# EAGLE design IO_board-ha-v1 (EAGLE 6.5.0)
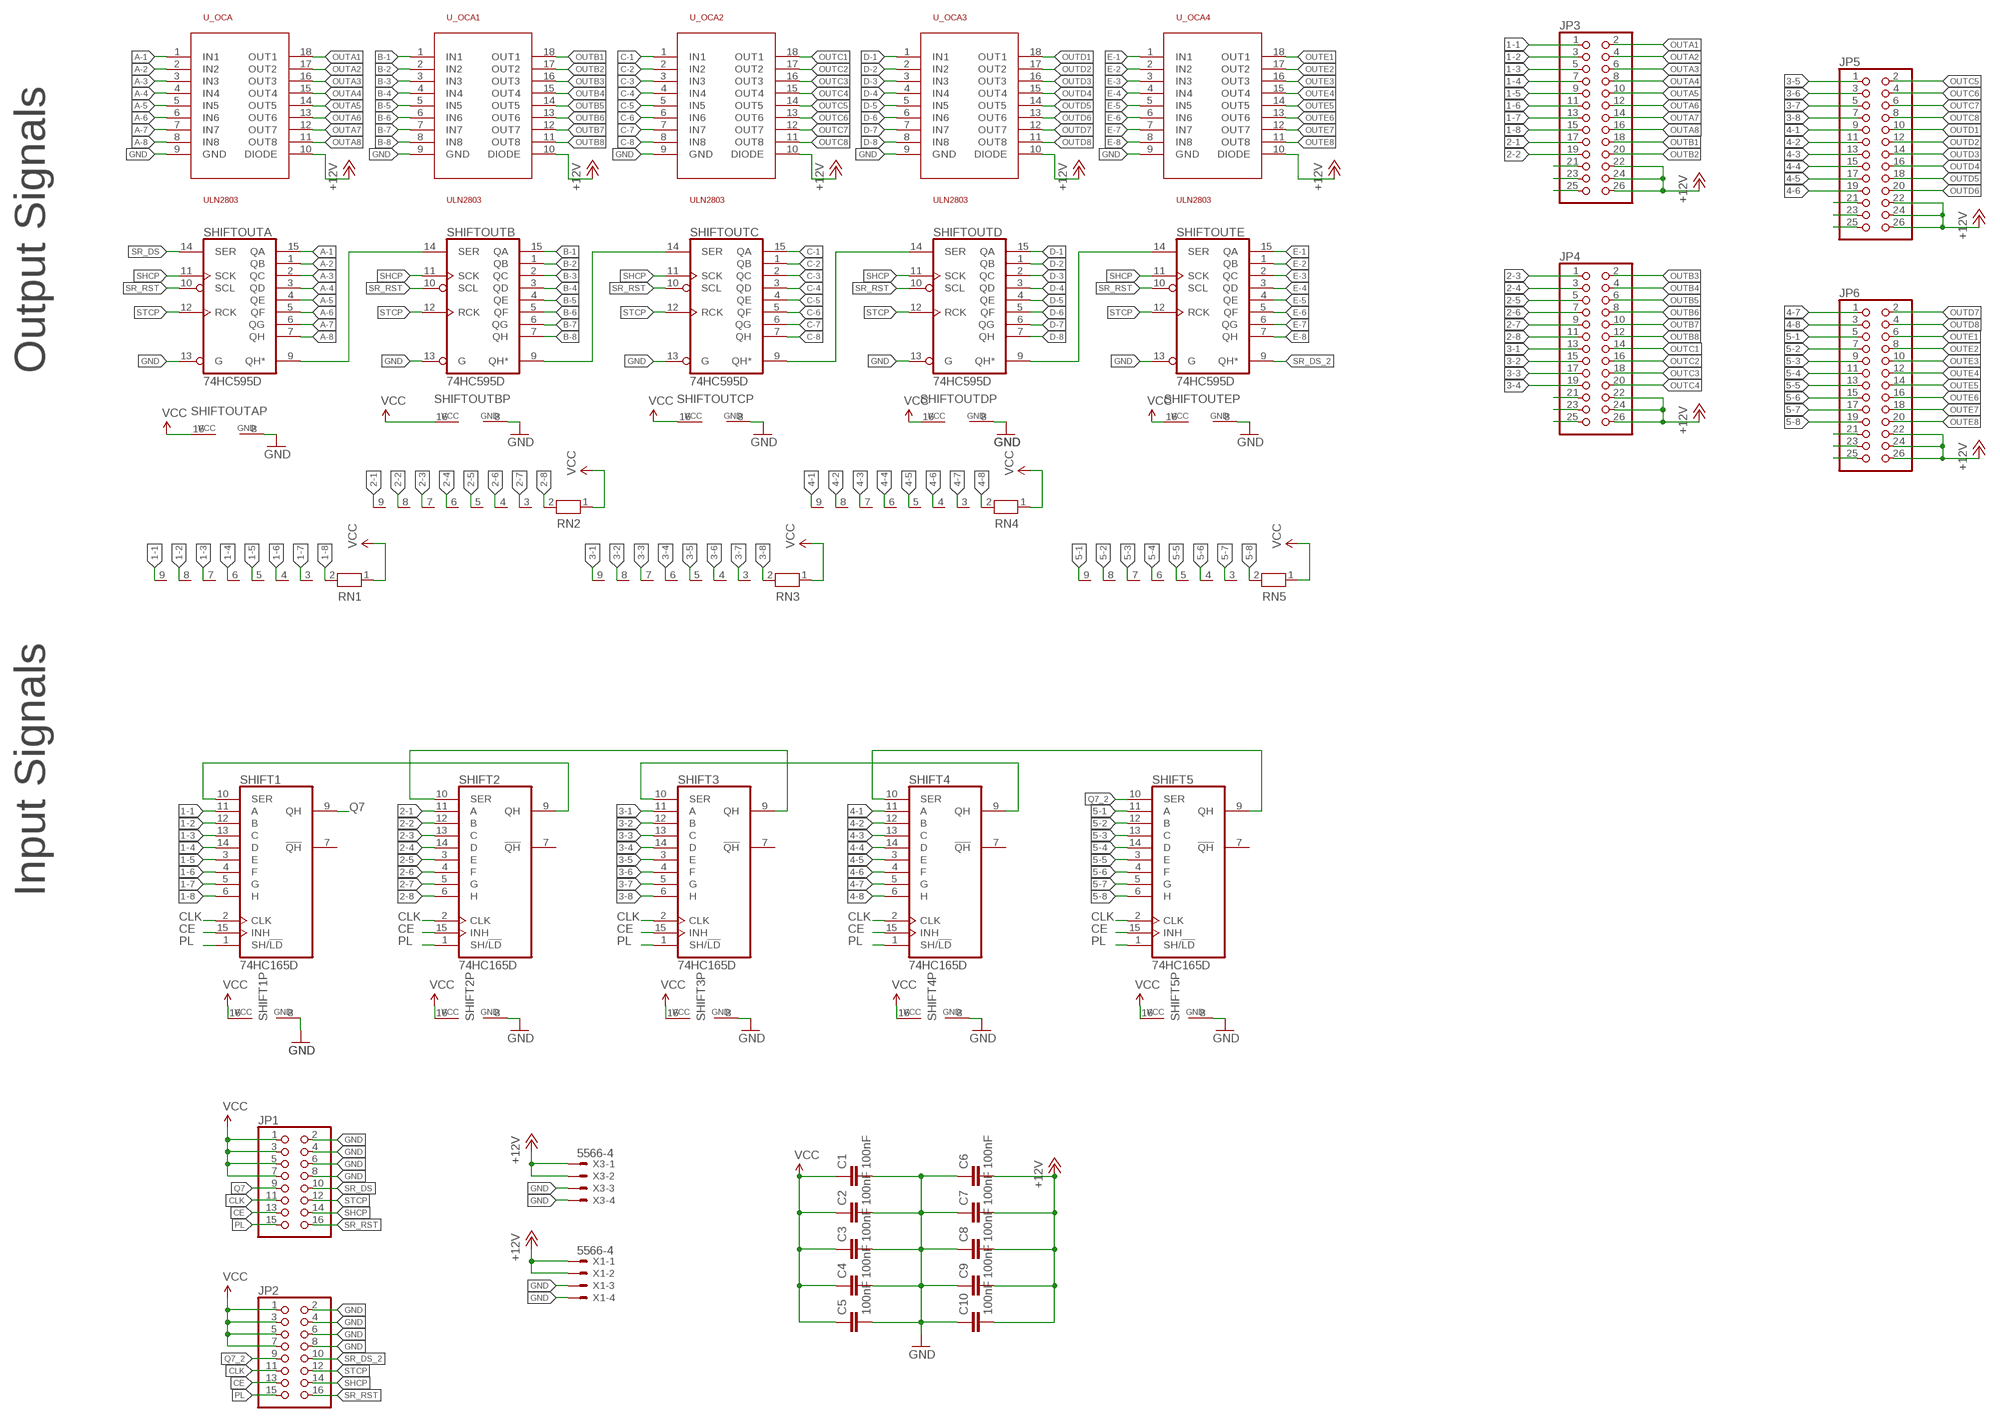
[diagram p0: schematic, sheet 1]

## Parts
C1  100nF  C-EUC0805  [C0805]
C2  100nF  C-EUC0805  [C0805]
C3  100nF  C-EUC0805  [C0805]
C4  100nF  C-EUC0805  [C0805]
C5  100nF  C-EUC0805  [C0805]
C6  100nF  C-EUC0805  [C0805]
C7  100nF  C-EUC0805  [C0805]
C8  100nF  C-EUC0805  [C0805]
C9  100nF  C-EUC0805  [C0805]
C10  100nF  C-EUC0805  [C0805]
JP1  PINHD-2X8  [2X08]
JP2  PINHD-2X8  [2X08]
JP3  PINHD-2X13  [2X13]
JP4  PINHD-2X13  [2X13]
JP5  PINHD-2X13  [2X13]
JP6  PINHD-2X13  [2X13]
RN1  RN08  [RN-9]
RN2  RN08  [RN-9]
RN3  RN08  [RN-9]
RN4  RN08  [RN-9]
RN5  RN08  [RN-9]
SHIFT1  74HC165D  [SO16]
SHIFT2  74HC165D  [SO16]
SHIFT3  74HC165D  [SO16]
SHIFT4  74HC165D  [SO16]
SHIFT5  74HC165D  [SO16]
SHIFTOUTA  74HC595D  [SO16]
SHIFTOUTB  74HC595D  [SO16]
SHIFTOUTC  74HC595D  [SO16]
SHIFTOUTD  74HC595D  [SO16]
SHIFTOUTE  74HC595D  [SO16]
U_OCA  ULN2803  [SO18L]
U_OCA1  ULN2803  [SO18L]
U_OCA2  ULN2803  [SO18L]
U_OCA3  ULN2803  [SO18L]
U_OCA4  ULN2803  [SO18L]
X1  5566-4  [5566-4]
X3  5566-4  [5566-4]

## Nets
1-1: JP3.1 RN1.9 SHIFT1.11(A)
1-2: JP3.3 RN1.8 SHIFT1.12(B)
1-3: JP3.5 RN1.7 SHIFT1.13(C)
1-4: JP3.7 RN1.6 SHIFT1.14(D)
1-5: JP3.9 RN1.5 SHIFT1.3(E)
1-6: JP3.11 RN1.4 SHIFT1.4(F)
1-7: JP3.13 RN1.3 SHIFT1.5(G)
1-8: JP3.15 RN1.2 SHIFT1.6(H)
2-1: JP3.17 RN2.9 SHIFT2.11(A)
2-2: JP3.19 RN2.8 SHIFT2.12(B)
2-3: JP4.1 RN2.7 SHIFT2.13(C)
2-4: JP4.3 RN2.6 SHIFT2.14(D)
2-5: JP4.5 RN2.5 SHIFT2.3(E)
2-6: JP4.7 RN2.4 SHIFT2.4(F)
2-7: JP4.9 RN2.3 SHIFT2.5(G)
2-8: JP4.11 RN2.2 SHIFT2.6(H)
3-1: JP4.13 RN3.9 SHIFT3.11(A)
3-2: JP4.15 RN3.8 SHIFT3.12(B)
3-3: JP4.17 RN3.7 SHIFT3.13(C)
3-4: JP4.19 RN3.6 SHIFT3.14(D)
3-5: JP5.1 RN3.5 SHIFT3.3(E)
3-6: JP5.3 RN3.4 SHIFT3.4(F)
3-7: JP5.5 RN3.3 SHIFT3.5(G)
3-8: JP5.7 RN3.2 SHIFT3.6(H)
4-1: JP5.9 RN4.9 SHIFT4.11(A)
4-2: JP5.11 RN4.8 SHIFT4.12(B)
4-3: JP5.13 RN4.7 SHIFT4.13(C)
4-4: JP5.15 RN4.6 SHIFT4.14(D)
4-5: JP5.17 RN4.5 SHIFT4.3(E)
4-6: JP5.19 RN4.4 SHIFT4.4(F)
4-7: JP6.1 RN4.3 SHIFT4.5(G)
4-8: JP6.3 RN4.2 SHIFT4.6(H)
5-1: JP6.5 RN5.9 SHIFT5.11(A)
5-2: JP6.7 RN5.8 SHIFT5.12(B)
5-3: JP6.9 RN5.7 SHIFT5.13(C)
5-4: JP6.11 RN5.6 SHIFT5.14(D)
5-5: JP6.13 RN5.5 SHIFT5.3(E)
5-6: JP6.15 RN5.4 SHIFT5.4(F)
5-7: JP6.17 RN5.3 SHIFT5.5(G)
5-8: JP6.19 RN5.2 SHIFT5.6(H)
+12V [power]: C6.2 C7.2 C8.2 C9.2 C10.2 JP3.22 JP3.24 JP3.26 JP4.22 JP4.24 JP4.26 JP5.22 JP5.24 JP5.26 JP6.22 JP6.24 JP6.26 U_OCA1.10(DIODE) U_OCA2.10(DIODE) U_OCA3.10(DIODE) U_OCA4.10(DIODE) U_OCA.10(DIODE) X1.1 X1.2 X3.1 X3.2
A-1: SHIFTOUTA.15(QA) U_OCA.1(IN1)
A-2: SHIFTOUTA.1(QB) U_OCA.2(IN2)
A-3: SHIFTOUTA.2(QC) U_OCA.3(IN3)
A-4: SHIFTOUTA.3(QD) U_OCA.4(IN4)
A-5: SHIFTOUTA.4(QE) U_OCA.5(IN5)
A-6: SHIFTOUTA.5(QF) U_OCA.6(IN6)
A-7: SHIFTOUTA.6(QG) U_OCA.7(IN7)
A-8: SHIFTOUTA.7(QH) U_OCA.8(IN8)
B-1: SHIFTOUTB.15(QA) U_OCA1.1(IN1)
B-2: SHIFTOUTB.1(QB) U_OCA1.2(IN2)
B-3: SHIFTOUTB.2(QC) U_OCA1.3(IN3)
B-4: SHIFTOUTB.3(QD) U_OCA1.4(IN4)
B-5: SHIFTOUTB.4(QE) U_OCA1.5(IN5)
B-6: SHIFTOUTB.5(QF) U_OCA1.6(IN6)
B-7: SHIFTOUTB.6(QG) U_OCA1.7(IN7)
B-8: SHIFTOUTB.7(QH) U_OCA1.8(IN8)
C-1: SHIFTOUTC.15(QA) U_OCA2.1(IN1)
C-2: SHIFTOUTC.1(QB) U_OCA2.2(IN2)
C-3: SHIFTOUTC.2(QC) U_OCA2.3(IN3)
C-4: SHIFTOUTC.3(QD) U_OCA2.4(IN4)
C-5: SHIFTOUTC.4(QE) U_OCA2.5(IN5)
C-6: SHIFTOUTC.5(QF) U_OCA2.6(IN6)
C-7: SHIFTOUTC.6(QG) U_OCA2.7(IN7)
C-8: SHIFTOUTC.7(QH) U_OCA2.8(IN8)
CE: JP1.13 JP2.13 SHIFT1.15(INH) SHIFT2.15(INH) SHIFT3.15(INH) SHIFT4.15(INH) SHIFT5.15(INH)
CLK: JP1.11 JP2.11 SHIFT1.2(CLK) SHIFT2.2(CLK) SHIFT3.2(CLK) SHIFT4.2(CLK) SHIFT5.2(CLK)
D-1: SHIFTOUTD.15(QA) U_OCA3.1(IN1)
D-2: SHIFTOUTD.1(QB) U_OCA3.2(IN2)
D-3: SHIFTOUTD.2(QC) U_OCA3.3(IN3)
D-4: SHIFTOUTD.3(QD) U_OCA3.4(IN4)
D-5: SHIFTOUTD.4(QE) U_OCA3.5(IN5)
D-6: SHIFTOUTD.5(QF) U_OCA3.6(IN6)
D-7: SHIFTOUTD.6(QG) U_OCA3.7(IN7)
D-8: SHIFTOUTD.7(QH) U_OCA3.8(IN8)
E-1: SHIFTOUTE.15(QA) U_OCA4.1(IN1)
E-2: SHIFTOUTE.1(QB) U_OCA4.2(IN2)
E-3: SHIFTOUTE.2(QC) U_OCA4.3(IN3)
E-4: SHIFTOUTE.3(QD) U_OCA4.4(IN4)
E-5: SHIFTOUTE.4(QE) U_OCA4.5(IN5)
E-6: SHIFTOUTE.5(QF) U_OCA4.6(IN6)
E-7: SHIFTOUTE.6(QG) U_OCA4.7(IN7)
E-8: SHIFTOUTE.7(QH) U_OCA4.8(IN8)
GND [GND]: C1.2 C2.2 C3.2 C4.2 C5.2 C6.1 C7.1 C8.1 C9.1 C10.1 JP1.2 JP1.4 JP1.6 JP1.8 JP2.2 JP2.4 JP2.6 JP2.8 JP3.21 JP3.23 JP3.25 JP4.21 JP4.23 JP4.25 JP5.21 JP5.23 JP5.25 JP6.21 JP6.23 JP6.25 SHIFT1.8(GND) SHIFT2.8(GND) SHIFT3.8(GND) SHIFT4.8(GND) SHIFT5.8(GND) SHIFTOUTA.8(GND) SHIFTOUTA.13(G) SHIFTOUTB.8(GND) SHIFTOUTB.13(G) SHIFTOUTC.8(GND) SHIFTOUTC.13(G) SHIFTOUTD.8(GND) SHIFTOUTD.13(G) SHIFTOUTE.8(GND) SHIFTOUTE.13(G) U_OCA1.9(GND) U_OCA2.9(GND) U_OCA3.9(GND) U_OCA4.9(GND) U_OCA.9(GND) X1.3 X1.4 X3.3 X3.4
N$18: SHIFT2.10(SER) SHIFT3.9(QH)
N$21: SHIFT3.10(SER) SHIFT4.9(QH)
N$22: SHIFT4.10(SER) SHIFT5.9(QH)
N$26: SHIFTOUTA.9(QH*) SHIFTOUTB.14(SER)
N$31: SHIFTOUTC.9(QH*) SHIFTOUTD.14(SER)
N$37: SHIFTOUTB.9(QH*) SHIFTOUTC.14(SER)
N$38: SHIFTOUTD.9(QH*) SHIFTOUTE.14(SER)
N$50: SHIFT1.10(SER) SHIFT2.9(QH)
OUTA1: JP3.2 U_OCA.18(OUT1)
OUTA2: JP3.4 U_OCA.17(OUT2)
OUTA3: JP3.6 U_OCA.16(OUT3)
OUTA4: JP3.8 U_OCA.15(OUT4)
OUTA5: JP3.10 U_OCA.14(OUT5)
OUTA6: JP3.12 U_OCA.13(OUT6)
OUTA7: JP3.14 U_OCA.12(OUT7)
OUTA8: JP3.16 U_OCA.11(OUT8)
OUTB1: JP3.18 U_OCA1.18(OUT1)
OUTB2: JP3.20 U_OCA1.17(OUT2)
OUTB3: JP4.2 U_OCA1.16(OUT3)
OUTB4: JP4.4 U_OCA1.15(OUT4)
OUTB5: JP4.6 U_OCA1.14(OUT5)
OUTB6: JP4.8 U_OCA1.13(OUT6)
OUTB7: JP4.10 U_OCA1.12(OUT7)
OUTB8: JP4.12 U_OCA1.11(OUT8)
OUTC1: JP4.14 U_OCA2.18(OUT1)
OUTC2: JP4.16 U_OCA2.17(OUT2)
OUTC3: JP4.18 U_OCA2.16(OUT3)
OUTC4: JP4.20 U_OCA2.15(OUT4)
OUTC5: JP5.2 U_OCA2.14(OUT5)
OUTC6: JP5.4 U_OCA2.13(OUT6)
OUTC7: JP5.6 U_OCA2.12(OUT7)
OUTC8: JP5.8 U_OCA2.11(OUT8)
OUTD1: JP5.10 U_OCA3.18(OUT1)
OUTD2: JP5.12 U_OCA3.17(OUT2)
OUTD3: JP5.14 U_OCA3.16(OUT3)
OUTD4: JP5.16 U_OCA3.15(OUT4)
OUTD5: JP5.18 U_OCA3.14(OUT5)
OUTD6: JP5.20 U_OCA3.13(OUT6)
OUTD7: JP6.2 U_OCA3.12(OUT7)
OUTD8: JP6.4 U_OCA3.11(OUT8)
OUTE1: JP6.6 U_OCA4.18(OUT1)
OUTE2: JP6.8 U_OCA4.17(OUT2)
OUTE3: JP6.10 U_OCA4.16(OUT3)
OUTE4: JP6.12 U_OCA4.15(OUT4)
OUTE5: JP6.14 U_OCA4.14(OUT5)
OUTE6: JP6.16 U_OCA4.13(OUT6)
OUTE7: JP6.18 U_OCA4.12(OUT7)
OUTE8: JP6.20 U_OCA4.11(OUT8)
PL: JP1.15 JP2.15 SHIFT1.1(SH/!LD) SHIFT2.1(SH/!LD) SHIFT3.1(SH/!LD) SHIFT4.1(SH/!LD) SHIFT5.1(SH/!LD)
Q7: JP1.9 SHIFT1.9(QH)
Q7_2: JP2.9 SHIFT5.10(SER)
SHCP: JP1.14 JP2.14 SHIFTOUTA.11(SCK) SHIFTOUTB.11(SCK) SHIFTOUTC.11(SCK) SHIFTOUTD.11(SCK) SHIFTOUTE.11(SCK)
SR_DS: JP1.10 SHIFTOUTA.14(SER)
SR_DS_2: JP2.10 SHIFTOUTE.9(QH*)
SR_RST: JP1.16 JP2.16 SHIFTOUTA.10(SCL) SHIFTOUTB.10(SCL) SHIFTOUTC.10(SCL) SHIFTOUTD.10(SCL) SHIFTOUTE.10(SCL)
STCP: JP1.12 JP2.12 SHIFTOUTA.12(RCK) SHIFTOUTB.12(RCK) SHIFTOUTC.12(RCK) SHIFTOUTD.12(RCK) SHIFTOUTE.12(RCK)
VCC [power]: C1.1 C2.1 C3.1 C4.1 C5.1 JP1.1 JP1.3 JP1.5 JP1.7 JP2.1 JP2.3 JP2.5 JP2.7 RN1.1 RN2.1 RN3.1 RN4.1 RN5.1 SHIFT1.16(VCC) SHIFT2.16(VCC) SHIFT3.16(VCC) SHIFT4.16(VCC) SHIFT5.16(VCC) SHIFTOUTA.16(VCC) SHIFTOUTB.16(VCC) SHIFTOUTC.16(VCC) SHIFTOUTD.16(VCC) SHIFTOUTE.16(VCC)
Unconnected: SHIFT1.7(!QH) SHIFT2.7(!QH) SHIFT3.7(!QH) SHIFT4.7(!QH) SHIFT5.7(!QH)

## Notes on the sheet
- Output Signals
- Input Signals

## Library data of the parts
C1-C10 = resistor:C-EU: CAPACITOR, European symbol
JP1 JP2 = pinhead:PINHD-2X8: PIN HEADER
JP3-JP6 = pinhead:PINHD-2X13: PIN HEADER
RN1-RN5 = resistor-net:RN08: RESISTOR NETWORK; OC_FARNELL: unknown; OC_NEWARK: unknown
SHIFT1-SHIFT5 = 74xx-eu:74*165: 8-bit parallel load SHIFT REGISTER
SHIFTOUTA SHIFTOUTB SHIFTOUTC SHIFTOUTD SHIFTOUTE = 74xx-eu:74*595: 8-bit SHIFT REGISTER, output latch
U_OCA U_OCA1-U_OCA4 = uln2803:ULN2803
X1 X3 = con-molex:5566-4: Mini FIT connector 4 pol Source: http://www.molex.com; OC_FARNELL: unknown; OC_NEWARK: unknown

## Net classes
1 power: width 0.305 mm, drill 0.6 mm, clearance 0.813 mm
2 GND: width 0.305 mm, drill 0.6 mm, clearance 0.508 mm
3 LIVEAC: width 0.508 mm, drill 0.508 mm, clearance 1.27 mm

## Board
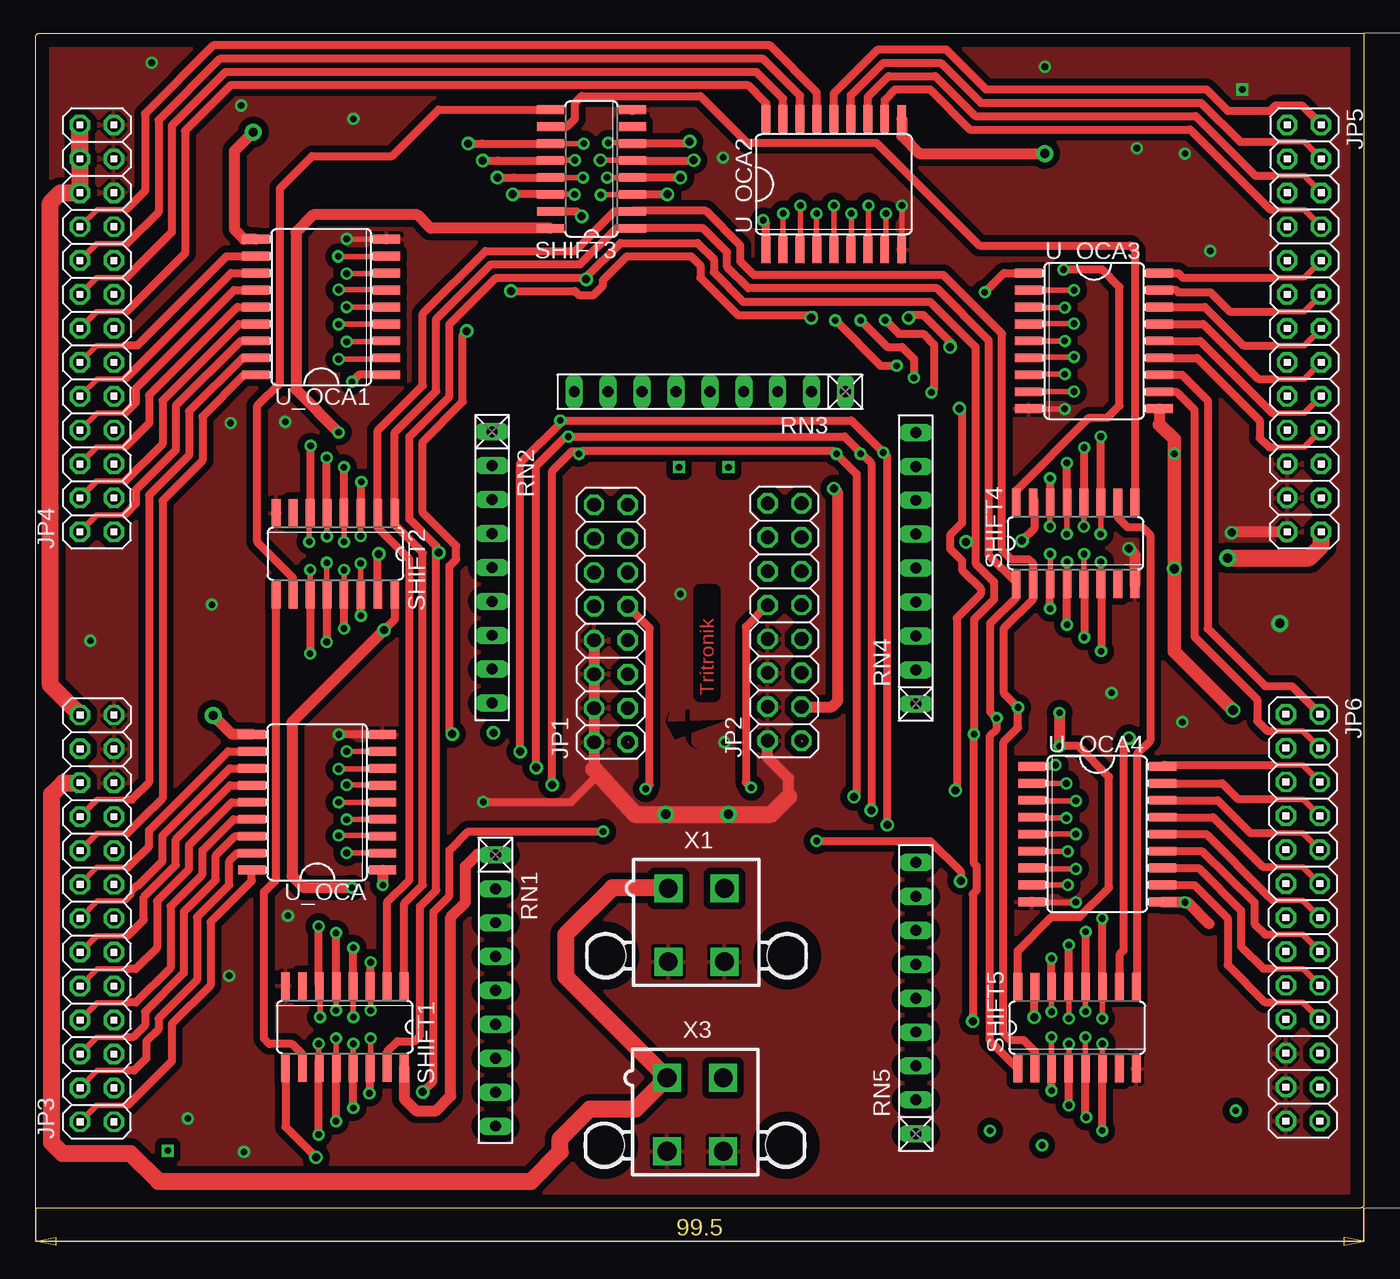
[diagram p1: board, top side]
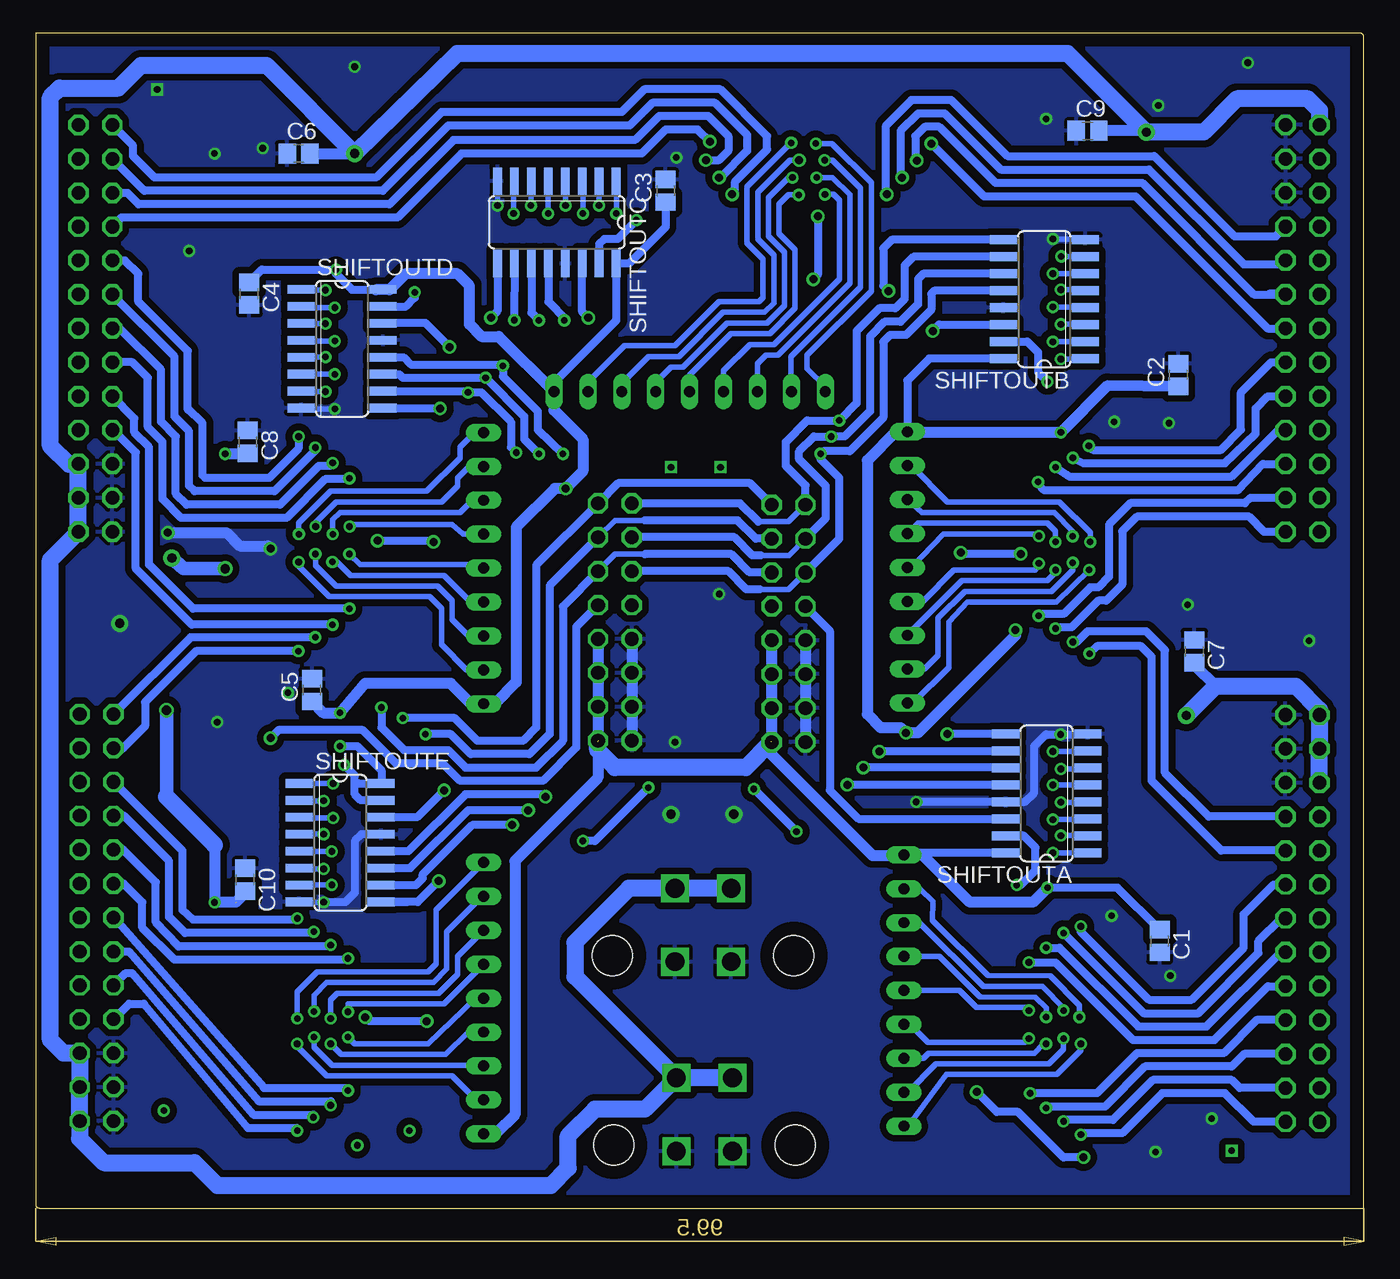
[diagram p2: board, bottom side, seen from below]

Size 99.5 x 88 mm. Coordinates in mm from the lower left corner, seen from the top.
Outline: 0,0 0,87.75 arc-90 0.25,88 99.5,88 99.5,0.25 arc-90 99.25,0 0,0
Copper layers (1*16): Top 0.035mm / dielectric 1.5mm / Bottom 0.035mm
Design rules "default": minimum track width 10mil, minimum drill 24mil, track to track 8mil, track to pad 8mil, pad to pad 8mil, via to via 8mil, smd to smd 8mil, copper to edge 40mil, drill to drill 8mil, minimum pad ring 10mil, minimum via ring 8mil, stop-mask expansion 4mil, vias tented up to drill 0mil, thermal gap 10mil

### Footprints (pad centres in the part's own frame; a part is rotated, then mirrored left to right if it is on the bottom)
C0805 = smd 1.3 x 1.5: 1 -0.85,0; 2 0.85,0
2X08 = drill 1.016 octagon: 1 -8.89,-1.27; 2 -8.89,1.27; 3 -6.35,-1.27; 4 -6.35,1.27; 5 -3.81,-1.27; 6 -3.81,1.27; 7 -1.27,-1.27; 8 -1.27,1.27; 9 1.27,-1.27; 10 1.27,1.27; 11 3.81,-1.27; 12 3.81,1.27; 13 6.35,-1.27; 14 6.35,1.27; 15 8.89,-1.27; 16 8.89,1.27
2X13 = drill 1.016 octagon: 1 -15.24,-1.27; 2 -15.24,1.27; 3 -12.7,-1.27; 4 -12.7,1.27; 5 -10.16,-1.27; 6 -10.16,1.27; 7 -7.62,-1.27; 8 -7.62,1.27; 9 -5.08,-1.27; 10 -5.08,1.27; 11 -2.54,-1.27; 12 -2.54,1.27; 13 0,-1.27; 14 0,1.27; 15 2.54,-1.27; 16 2.54,1.27; 17 5.08,-1.27; 18 5.08,1.27; 19 7.62,-1.27; 20 7.62,1.27; 21 10.16,-1.27; 22 10.16,1.27; 23 12.7,-1.27; 24 12.7,1.27; 25 15.24,-1.27; 26 15.24,1.27
RN-9 = drill 0.813 long: 1 -10.16,0; 2 -7.62,0; 3 -5.08,0; 4 -2.54,0; 5 0,0; 6 2.54,0; 7 5.08,0; 8 7.62,0; 9 10.16,0
SO16 = smd 0.66 x 2.032: 1 -4.445,-3.073; 2 -3.175,-3.073; 3 -1.905,-3.073; 4 -0.635,-3.073; 5 0.635,-3.073; 6 1.905,-3.073; 7 3.175,-3.073; 8 4.445,-3.073; 9 4.445,3.073; 10 3.175,3.073; 11 1.905,3.073; 12 0.635,3.073; 13 -0.635,3.073; 14 -1.905,3.073; 15 -3.175,3.073; 16 -4.445,3.073
SO18L = smd 0.66 x 2.032: 1 -5.08,-4.902; 2 -3.81,-4.902; 3 -2.54,-4.902; 4 -1.27,-4.902; 5 0,-4.902; 6 1.27,-4.902; 7 2.54,-4.902; 8 3.81,-4.902; 9 5.08,-4.902; 10 5.08,4.902; 11 3.81,4.902; 12 2.54,4.902; 13 1.27,4.902; 14 0,4.902; 15 -1.27,4.902; 16 -2.54,4.902; 17 -3.81,4.902; 18 -5.08,4.902
5566-4 = drill 1.4 square: 1 2.1,-2.75; 2 -2.1,-2.75; 3 2.1,2.75; 4 -2.1,2.75 | hole 3: 6.8,2.29; -6.8,2.29

### Placement (x,y rotation side)
C1  15.3,20 270 bottom
C2  13.9,62.4 90 bottom
C3  52.3,76.2 90 bottom
C4  83.5,68.5 270 bottom
C5  78.8,38.8 90 bottom
C6  79.8,79 0 bottom
C7  12.7,41.7 270 bottom
C8  83.6,57.4 270 bottom
C9  20.7,80.7 0 bottom
C10  83.8,24.6 270 bottom
JP1  43.1,43.8 90 top
JP2  56.1,43.9 90 top
JP3  4.6,21.7 90 top
JP4  4.59,65.9 90 top
JP5  95.03,65.9 270 top
JP6  94.93,21.76 270 top
RN1  34.45,16.3 270 top
RN2  34.19,47.99 270 top
RN3  50.51,61.16 180 top
RN4  65.94,47.94 90 top
RN5  65.94,15.72 90 top
SHIFT1  23.16,13.56 180 top
SHIFT2  22.46,49.01 180 top
SHIFT3  41.64,77.84 90 top
SHIFT4  77.9,49.8 0 top
SHIFT5  78.02,13.51 0 top
SHIFTOUTA  23.76,31.06 90 bottom
SHIFTOUTB  23.94,68.09 90 bottom
SHIFTOUTC  60.46,73.84 180 bottom
SHIFTOUTD  76.55,64.37 270 bottom
SHIFTOUTE  76.68,27.37 270 bottom
U_OCA  21.1,30.4 90 top
U_OCA1  21.4,67.5 90 top
U_OCA2  59.8,76.7 0 top
U_OCA3  79.29,64.96 270 top
U_OCA4  79.52,28.01 270 top
X1  49.5,21.2 180 top
X3  49.4,7 180 top

### Tracks (layer width: path | path; a pad name or v marks a point on that pad's centre or on a via)
1-1  (via drill 0.5)
  Top 0.406: SHIFT1.11 21.2,10.54 21.2,11.1 v21.2,12.3
  Top 0.61: v21.2,5.5 21.2,11.1
  Bottom 0.406: v21.2,12.3 21.2,11.8 23,10 31.27,10.01 34.13,6.15 RN1.9
  Bottom 0.61: JP3.1 8.26,6.46 10.4,8.6 15.1,8.6 18.1,5.6 21.2,5.6 v21.2,5.5
1-2  (via drill 0.5)
  Top 0.406: SHIFT1.12 22.5,10.51 v22.5,12.7
  Top 0.61: v22.5,6.5 22.52,6.42 SHIFT1.12
  Bottom 0.406: v22.5,12.7 22.5,11.9 23.6,10.8 32.04,10.79 34.16,8.67 RN1.8
  Bottom 0.61: JP3.3 9.3,9 9.9,9.6 15.8,9.6 18.8,6.6 22.5,6.6 v22.5,6.5
1-3  (via drill 0.5)
  Top 0.406: SHIFT1.13 v23.8,12.3
  Top 0.61: v23.8,7.5 23.8,7.41 SHIFT1.13
  Bottom 0.406: v23.8,12.3 24,12.3 24.7,11.6 32.62,11.59 33,11.21 RN1.7
  Bottom 0.61: JP3.5 8.96,11.54 9.9,10.6 16.4,10.6 19.4,7.6 23.8,7.6 v23.8,7.5
1-4  (via drill 0.5)
  Top 0.406: SHIFT1.14 25.1,10.52 v25.1,12.7
  Top 0.61: v25,8.6 25.07,8.66 SHIFT1.14
  Bottom 0.406: v25.1,12.7 25.4,12.4 30.6,12.4 30.61,12.41 32.67,12.4 34.02,13.75 RN1.6
  Bottom 0.61: JP3.7 8.02,14.08 10.5,11.6 17,11.6 20,8.6 v25,8.6
1-5  (via drill 0.5)
  Top 0.406: v25.1,14.8 25.1,16.6 SHIFT1.3 25.1,16.67
  Top 0.61: 25.1,16.67 v25.1,18.4
  Bottom 0.406: v25.1,14.8 25.32,15.02 29.02,15.02 30.3,16.3 RN1.5
  Bottom 0.61: v25.1,18.4 23.1,18.4 17.3,12.6 11.2,12.6 7.18,16.62 JP3.9
1-6  (via drill 0.5)
  Top 0.406: SHIFT1.4 v23.8,14.3
  Top 0.61: SHIFT1.4 v23.8,19.5
  Bottom 0.406: v23.8,14.3 23.8,15 24.6,15.8 28.7,15.82 28.76,15.82 31.78,18.84 RN1.4
  Bottom 0.61: 23.8,19.4 v23.8,19.5 22.8,19.5 16.9,13.6 11.8,13.6 6.24,19.16 JP3.11
1-7  (via drill 0.5)
  Top 0.406: SHIFT1.5 22.5,16.61 v22.5,14.8
  Top 0.61: 22.5,16.61 v22.5,20.6
  Bottom 0.406: v22.5,14.8 22.5,15 24.1,16.6 28.39,16.61 28.51,16.61 33.28,21.38 RN1.3 34.37,21.39
  Bottom 0.61: v22.5,20.6 16.5,14.6 12.4,14.6 7.9,19.1 7.9,20 6.2,21.7 JP3.13
1-8  (via drill 0.5)
  Top 0.406: SHIFT1.6 21.3,16.59 v21.3,14.3
  Top 0.61: SHIFT1.6 21.2,16.69 v21.2,21.1
  Bottom 0.406: v21.3,14.3 21.3,15.2 23.5,17.4 28.18,17.42 32.31,21.55 32.3,22.96 33.25,23.91 RN1.2
  Bottom 0.61: v21.2,21.1 21.2,20.7 16.1,15.6 12.9,15.6 9,19.5 9,22 6.76,24.24 JP3.15
2-1  (via drill 0.5)
  Top 0.406: SHIFT2.11 v20.57,47.81
  Top 0.61: SHIFT2.11 v20.55,41.53
  Bottom 0.406: v20.57,47.81 23.05,45.4 29.7,45.4 31.1,43.9 31.1,40.5 33.77,37.83 RN2.9
  Bottom 0.61: JP3.17 10.68,26.78 15.9,32 15.9,41.3 16.7,42.1 19.98,42.1 v20.55,41.53
2-2  (via drill 0.5)
  Top 0.406: SHIFT2.12 21.81,45.95 v21.81,48.34
  Top 0.61: SHIFT2.12 21.8,45.91 v21.8,42.4
  Bottom 0.406: v21.81,48.34 21.81,47.79 23.4,46.2 29.9,46.2 31.9,44.2 31.9,41.4 32.93,40.37 RN2.8
  Bottom 0.61: v21.8,42.4 21.5,42.4 20.7,43.2 16.3,43.2 14.9,41.8 14.9,32.6 11.62,29.32 JP3.19
2-3  (via drill 0.5)
  Top 0.406: SHIFT2.13 v23.1,47.8
  Top 0.61: v23.1,43.42 SHIFT2.13
  Bottom 0.406: v23.1,47.8 23.1,47.6 23.7,47 30.1,47 34.1,43 RN2.7
  Bottom 0.61: JP4.1 7.46,50.66 8.6,51.8 17,51.8 18.1,50.7 18.1,46.7 19.3,45.5 19.9,45.5 21.9,43.5 23.1,43.5 v23.1,43.42
2-4  (via drill 0.5)
  Top 0.406: SHIFT2.14 24.35,45.95 24.35,46.5 v24.35,48.29
  Top 0.61: v24.36,44.37 v24.35,44.38 24.35,46.5
  Bottom 0.406: v24.35,48.29 24.35,48.25 24.6,47.8 30.7,47.8 33.05,45.45 RN2.6
  Bottom 0.61: JP4.3 8.5,53.2 8.9,52.8 17.5,52.8 19.1,51.2 19.1,47.3 19.9,46.5 20.5,46.5 22.49,44.51 24.36,44.51 v24.36,44.37
2-5  (via drill 0.5)
  Top 0.406: SHIFT2.3 24.35,52.07 v24.35,50.34
  Top 0.61: 24.35,52.07 24.4,52.12 v24.4,54.4
  Bottom 0.406: v24.35,50.34 v24.35,50.35 24.5,50.5 31.5,50.5 33.91,47.99 RN2.5
  Bottom 0.61: JP4.5 7.56,55.74 9.4,53.8 24,53.8 24.4,54.2 v24.4,54.4
2-6  (via drill 0.5)
  Top 0.406: SHIFT2.4 v23.1,49.9
  Top 0.61: SHIFT2.4 v23.1,55.5
  Bottom 0.406: v23.1,49.9 23.1,50.7 23.7,51.3 33.4,51.3 34.17,50.53 RN2.4
  Bottom 0.61: v23.1,55.5 22.2,54.9 22.02,54.79 9.9,54.8 6.42,58.28 JP4.7
2-7  (via drill 0.5)
  Top 0.406: SHIFT2.5 v21.82,50.32
  Top 0.61: SHIFT2.5 21.8,52.11 v21.8,56.2
  Bottom 0.406: v21.82,50.32 21.82,50.72 23.2,52.1 33.12,52.1 RN2.3
  Bottom 0.61: v21.8,56.2 21,55.8 10.4,55.8 8.1,58 8.1,59.9 7.18,60.82 JP4.9
2-8  (via drill 0.5)
  Top 0.406: SHIFT2.6 20.5,52.03 v20.5,49.9
  Top 0.61: SHIFT2.6 20.6,52.13 v20.6,57.1
  Bottom 0.406: v20.5,49.9 20.5,50.6 22.8,52.9 31.2,52.9 33.91,55.61 RN2.2
  Bottom 0.61: JP4.11 6.94,63.36 9.2,61.1 9.2,58.3 10.7,56.8 20.3,56.8 v20.6,57.1
3-1  (via drill 0.5, 0.6)
  Top 0.406: SHIFT3.11 v41.05,79.75
  Top 0.61: v32.41,79.75 33.45,79.75 SHIFT3.11
  Bottom 0.406: v41.05,79.75 39.84,79.75 36.9,76.8 36.9,68.7 41.7,63.9 41.7,62.9 40.35,61.55 RN3.9
  Bottom 0.61: 5.9,65.9 JP4.13 7.2,65.9 17.1,75.8 28.46,75.8 v32.41,79.75
3-2  (via drill 0.5, 0.6)
  Top 0.406: SHIFT3.12 38.59,78.5 v40.4,78.5
  Top 0.61: v33.49,78.47 34.62,78.47 SHIFT3.12
  Bottom 0.406: v40.4,78.5 39.8,78.5 37.7,76.4 37.7,69 42.9,63.8 RN3.8
  Bottom 0.61: 7.1,68.5 5.92,68.5 JP4.15 8.24,68.44 16.6,76.8 27.6,76.8 31.8,81 32.9,81 33.6,80.3 33.6,78.58 v33.49,78.47
3-3  (via drill 0.5, 0.6)
  Top 0.406: SHIFT3.13 41.09,77.2 v41,77.2
  Top 0.61: v34.6,77.2 35.8,77.2 SHIFT3.13
  Bottom 0.406: v41,77.2 39.8,77.2 38.5,75.9 38.5,69.3 43.9,63.9 44.8,63.9 45.43,63.27 RN3.7
  Bottom 0.61: JP4.17 6.14,70.7 9,70.7 16.1,77.8 27.2,77.8 31.4,82 33.4,82 34.7,80.7 34.7,77.3 v34.6,77.2
3-4  (via drill 0.5, 0.6)
  Top 0.406: SHIFT3.14 v40.37,75.94
  Top 0.61: SHIFT3.14 v35.73,75.94
  Bottom 0.406: v40.37,75.94 39.73,75.94 39.3,75.5 39.3,69.6 44.2,64.7 46,64.7 47.97,62.73 RN3.6
  Bottom 0.61: JP4.19 6.58,72.8 9.7,72.8 15.7,78.8 26.7,78.8 30.9,83 33.9,83 35.8,81.1 35.8,76.01 v35.73,75.94
3-5  (via drill 0.5, 0.6)
  Top 0.406: SHIFT3.3 44.68,75.9 v42.34,75.9
  Top 0.61: SHIFT3.3 v47.32,75.94
  Bottom 0.406: RN3.5 50.5,62.4 47.4,65.5 44.5,65.5 42.6,67.4 42.6,71.8 43.8,73 43.8,75.2 43.1,75.9 v42.34,75.9
  Bottom 0.61: JP5.1 92.2,79.58 92.2,78.8 90.6,77.2 74,77.2 69.1,82.1 55.6,82.1 53.9,83.8 48.2,83.8 44.7,80.3 44.7,79.3 47.1,76.9 47.1,76 47.16,75.94 v47.32,75.94
3-6  (via drill 0.5, 0.6)
  Top 0.406: SHIFT3.4 v42.8,77.2
  Top 0.61: v48.3,77.2 SHIFT3.4
  Bottom 0.406: v42.8,77.2 43.1,77.2 44.6,75.7 44.6,72.8 43.4,71.6 43.4,67.6 44.7,66.3 47.7,66.3 51,63 51.9,63 53.05,61.85 RN3.4
  Bottom 0.61: 92.86,77.7 JP5.3 91.36,76.2 73.5,76.2 68.6,81.1 55,81.1 53.3,82.8 48.6,82.8 46.2,80.4 46.2,79.2 48.2,77.2 v48.3,77.2
3-7  (via drill 0.6)
  Top 0.406: SHIFT3.5 44.69,78.5 v42.3,78.5
  Top 0.61: SHIFT3.5 49.27,78.47 v49.3,78.5
  Bottom 0.406: v42.3,78.5 43,78.5 45.4,76.1 45.4,72.6 44.2,71.4 44.2,67.8 44.9,67.1 48,67.1 51.3,63.8 53.6,63.8 55.59,61.81 RN3.3
  Bottom 0.61: JP5.5 92.64,76.06 91.78,75.2 73,75.2 68.2,80 54.6,80 52.8,81.8 49.1,81.8 47.6,80.3 47.6,79.2 48.3,78.5 v49.3,78.5
3-8  (via drill 0.5, 0.6)
  Top 0.406: SHIFT3.6 44.66,79.8 v42.9,79.8
  Top 0.61: v49,79.9 48.84,79.75 SHIFT3.6
  Bottom 0.406: v42.9,79.8 46.2,76.5 46.2,72.3 45,71.1 45,68.2 45.3,67.9 48.3,67.9 51.6,64.6 55.4,64.6 58.13,61.87 RN3.2
  Bottom 0.61: v49,79.9 49.9,80.8 52.3,80.8 54.1,79 67.6,79 72.4,74.2 93.08,74.2 JP5.7
4-1  (via drill 0.5 pad 0.25)
  Top 0.406: SHIFT4.11 79.78,52.85 v79.78,50.48
  Top 0.61: SHIFT4.11 v79.8,57.8
  Bottom 0.406: v79.78,50.48 79.78,51.32 77.4,53.7 70.2,53.7 67.7,56.2 67.7,57 66.6,58.1 RN4.9
  Bottom 0.61: JP5.9 92.82,70.98 91.8,70 91.8,67.9 88.1,64.2 88.1,59.9 | v79.8,57.8 79.8,56.9 82,54.7 86.8,54.7 87,54.9 87,58.8 88.1,59.9 | 88.1,59.8 88.1,59.9
4-2  (via drill 0.5 pad 0.25)
  Top 0.406: SHIFT4.12 v78.53,51.06
  Top 0.61: SHIFT4.12 78.55,52.89 v78.55,56.97
  Bottom 0.406: v78.53,51.06 78.54,51.36 77,52.9 69.1,52.9 67.9,54.1 67.9,54.7 67.04,55.56 RN4.8
  Bottom 0.61: v78.55,56.97 78.55,56.75 81.6,53.7 87.6,53.7 88,54.1 88,58.2 89.1,59.3 89.1,63.78 JP5.11
4-3  (via drill 0.5 pad 0.25)
  Top 0.406: SHIFT4.13 77.24,52.85 v77.24,50.48
  Top 0.61: SHIFT4.13 77.25,52.89 v77.25,55.82
  Bottom 0.406: v77.24,50.48 77.24,51.56 76.7,52.1 67.7,52.1 66.78,53.02 RN4.7
  Bottom 0.61: JP5.13 93.2,65.9 90.1,62.8 90.1,58.9 89,57.8 89,53.5 88.2,52.7 81.2,52.7 78.3,55.6 77.47,55.6 v77.25,55.82
4-4  (via drill 0.5 pad 0.25)
  Top 0.406: SHIFT4.14 v75.99,51.06
  Top 0.61: SHIFT4.14 v76,54.67
  Bottom 0.406: v75.99,51.06 75.85,51.2 68.3,51.2 67.48,50.48 RN4.6
  Bottom 0.61: v76,54.67 76.13,54.67 76.2,54.6 | JP5.15 92.26,63.36 91.1,62.2 91.1,58.5 90,57.4 90,53.1 88.6,51.7 80.7,51.7 77.8,54.6 76.2,54.6 | 76.2,54.6 76.1,54.6
4-5  (via drill 0.5 pad 0.25)
  Top 0.406: SHIFT4.3 v76,49
  Top 0.61: v76,44.9 v76,44.91 SHIFT4.3
  Bottom 0.406: v76,49 75.2,48.2 66.2,48.2 RN4.5
  Bottom 0.61: v76,44.9 87.7,44.9 91,48.2 91,57 92.1,58.1 92.1,59.16 JP5.17
4-6  (via drill 0.5 pad 0.25)
  Top 0.406: SHIFT4.4 v77.27,48.41
  Top 0.61: v77.26,43.7 SHIFT4.4
  Bottom 0.406: v77.27,48.41 76.91,48.41 75.9,47.4 68.9,47.4 66.9,45.4 RN4.4
  Bottom 0.61: v77.26,43.7 87.8,43.7 92,47.9 92,56.6 93.68,58.28 JP5.19
4-7  (via drill 0.5 pad 0.25)
  Top 0.406: SHIFT4.5 v78.54,49
  Top 0.61: SHIFT4.5 78.55,46.71 v78.55,42.76
  Bottom 0.406: v78.54,49 78.54,48.14 77,46.6 69.4,46.6 68.3,45.5 68.3,44.1 67.06,42.86 RN4.3
  Bottom 0.61: v78.55,42.76 87.9,42.76 JP6.1
4-8  (via drill 0.5 pad 0.25)
  Top 0.406: SHIFT4.6 v79.8,48.4
  Top 0.61: SHIFT4.6 79.82,46.71 v79.82,41.72
  Bottom 0.406: v79.8,48.4 79.8,48.1 77.5,45.8 70,45.8 69.1,44.9 69.1,42.2 67.22,40.32 RN4.2
  Bottom 0.61: v79.82,41.72 87.48,41.72 91.3,37.9 91.3,36.1 92.94,34.46 JP6.3
5-1  (via drill 0.5 pad 0.25)
  Top 0.406: 79.9,16.56 v79.9,14.2
  Top 0.61: 79.9,16.56 SHIFT5.11 79.92,21.57 v79.9,21.7
  Bottom 0.406: v79.9,14.2 79.9,16.2 78.4,17.7 70.1,17.7 69.5,18.3 69.49,22.34 RN5.9
  Bottom 0.61: JP6.5 88.5,26.76 88.5,22.3 87.7,21.6 80,21.6 v79.9,21.7
5-2  (via drill 0.5 pad 0.25)
  Top 0.406: SHIFT5.12 v78.65,14.72
  Top 0.61: SHIFT5.12 v78.66,20.7
  Bottom 0.406: v78.65,14.72 78.65,15.95 77.7,16.9 69.7,16.9 68.7,17.9 68.7,20.7 66.06,23.34 RN5.8
  Bottom 0.61: v78.66,20.7 78.76,20.6 88.3,20.6 89.5,21.8 89.5,26 92.88,29.38 JP6.7
5-3  (via drill 0.5 pad 0.25)
  Top 0.406: 77.4,16.57 v77.4,14.2
  Top 0.61: 77.4,16.57 SHIFT5.13 77.4,16.6 v77.4,19.7
  Bottom 0.406: v77.4,14.2 77.4,15.6 76.9,16.1 69.3,16.1 67.9,17.5 67.9,18.84 RN5.7
  Bottom 0.61: JP6.9 92.94,26.84 90.5,24.4 90.5,21.4 88.8,19.6 77.5,19.6 v77.4,19.7
5-4  (via drill 0.5 pad 0.25)
  Top 0.406: 76.1,16.57 v76.1,14.7
  Top 0.61: 76.1,16.57 SHIFT5.14 76.1,16.6 v76.1,18.7
  Bottom 0.406: v76.1,14.7 76.1,15.3 68.9,15.3 RN5.6
  Bottom 0.61: v76.1,18.7 76.2,18.6 89.1,18.6 91.5,21 91.5,22.9 92.9,24.3 JP6.11
5-5  (via drill 0.5 pad 0.25)
  Top 0.406: SHIFT5.3 76.1,10.45 76.1,11 v76.1,12.8
  Top 0.61: v76.1,8.8 76.1,11
  Bottom 0.406: v76.1,12.8 75.6,12.3 70.1,12.3 66.55,15.72 RN5.5
  Bottom 0.61: JP6.13 82.4,9 76.1,9 v76.1,8.8
5-6  (via drill 0.5 pad 0.25)
  Top 0.406: SHIFT5.4 77.4,10.45 77.4,11.3 v77.4,12.3
  Top 0.61: v77.4,7.7 77.4,11.3
  Bottom 0.406: v77.4,12.3 76.6,11.5 68.8,11.5 67.12,13.18 RN5.4
  Bottom 0.61: JP6.15 92.52,19.22 82.8,8 77.4,8 v77.4,7.7
5-7  (via drill 0.5 pad 0.25)
  Top 0.406: SHIFT5.5 78.65,11.2 v78.65,12.8
  Top 0.61: v78.7,6.8 78.65,6.85 78.65,11.2
  Bottom 0.406: v78.65,12.8 78.65,12.05 77.3,10.7 66,10.7 RN5.3
  Bottom 0.61: JP6.17 92.74,17.6 92.3,17.6 83.2,7 78.7,7 v78.7,6.8
5-8  (via drill 0.5 pad 0.25)
  Top 0.406: SHIFT5.6 79.91,10.45 v79.91,12.3
  Top 0.61: v79.9,5.8 79.92,5.83 SHIFT5.6
  Bottom 0.406: v79.91,12.3 79.91,12.11 77.7,9.9 68.3,9.9 66.5,8.1 RN5.2
  Bottom 0.61: JP6.19 92.5,15.3 91.4,15.3 83.6,6 79.93,6 79.9,5.97 v79.9,5.8
+12V  (via drill 0.5, 0.5 pad 0.25, 0.7 pad 1.02, 0.7 pad 1.27)  (1 unrouted)
  Top 0.813: U_OCA4.10 86.27,22.93 87.9,21.3 | U_OCA3.10 84.19,58.71 | U_OCA1.10 15.62,72.58 14.9,73.3 14.9,79.2 v16.3,80.6 | U_OCA.10 14.72,35.48 v13.3,36.9 | U_OCA2.10 64.88,80.32 66.2,79 v75.6,79
  Top 1.016: 84.19,58.71 85.3,57.6 v85.3,56.5 v85.3,47.9 85.3,41.7 v89.7,37.3
  Top 1.27: v89.3,48.7 95.4,48.7 96.3,49.6 JP5.26 | 47.4,24 43.2,24 39.7,20.5 39.7,17.35 X3.1 44.95,7.4 41.5,7.4 39.3,5.2 39.3,4.2 37.1,2 9.2,2 7.1,4.1 2,4.1 1.2,4.9 1.2,31 2.05,31.85 JP3.22 | JP3.26 1.1,39.17 1.1,75.3 1.86,76.06 JP4.22 JP4.24 | JP4.24 3.32,80.92 3.4,81 3.4,81.06 JP4.26 JP4.24
  Bottom 0.813: 86.1,27.2 v86.1,22.9 84.5,22.9 83.9,23.5 83.9,23.65 C10.2 | C7.2 12.7,40.7 11.1,39.1 | v16.3,80.6 16.4,80.7 C9.2 | C6.2 v75.6,79 | C8.2 83.65,56.5 v85.3,56.5
  Bottom 1.016: v85.3,47.9 88.4,47.9 v89.3,48.7 | v89.7,37.3 89.7,30.8
  Bottom 1.27: 89.7,30.8 86.1,27.2 | X1.1 X1.2 55.05,23.95 59.1,19.9 59.1,17.35 X3.2 | X3.1 X3.2 | X3.2 53.85,7.4 57.6,7.4 59.6,5.4 59.6,3 60.9,1.7 85.9,1.7 87.6,3.4 94.4,3.4 96.2,5.2 JP6.26 JP6.24 JP6.22 97.4,11.6 98.4,12.6 98.4,48.56 JP5.26 JP5.24 96.3,55.7 | JP3.22 JP3.24 JP3.26 3.33,37.33 5.1,39.1 11.1,39.1 v13.3,36.9 | 96.3,55.7 JP5.22 | JP4.26 3.32,82.22 4.2,83.1 9.5,83.1 12,80.6 v16.3,80.6 22.2,86.5 67.9,86.5 v75.6,79 82.2,85.6 91.6,85.6 93.3,83.9 97.7,83.9 98.4,83.2 98.4,57.1 97,55.7 96.3,55.7
A-1  (via drill 0.5 pad 0.25)
  Top 0.813: U_OCA.1 v26,24.2
  Bottom 0.61: v26,24.2 25.7,24.2 24.6,25.3 24.6,27 25.5,27.9 26.82,27.9 SHIFTOUTA.15
A-2  (via drill 0.5)
  Top 0.406: v23.3,26.6 U_OCA.2
  Bottom 0.406: SHIFTOUTA.1 20.67,26.6 v23.3,26.6
A-3  (via drill 0.5)
  Top 0.406: v22.7,27.9 25.96,27.9 U_OCA.3
  Bottom 0.406: SHIFTOUTA.2 20.67,27.9 v22.7,27.9
A-4  (via drill 0.5)
  Top 0.406: v23.3,29.1 25.97,29.1 U_OCA.4
  Bottom 0.406: SHIFTOUTA.3 20.63,29.1 v23.3,29.1
A-5  (via drill 0.5)
  Top 0.406: v22.7,30.4 U_OCA.5
  Bottom 0.406: SHIFTOUTA.4 21.07,30.43 21.1,30.4 v22.7,30.4
A-6  (via drill 0.5)
  Top 0.406: v23.3,31.7 25.97,31.7 U_OCA.6
  Bottom 0.406: SHIFTOUTA.5 v23.3,31.7
A-7  (via drill 0.5)
  Top 0.406: v22.7,32.9 25.96,32.9 U_OCA.7
  Bottom 0.406: SHIFTOUTA.6 20.62,32.9 v22.7,32.9
A-8  (via drill 0.5)
  Top 0.406: v23.3,34.2 U_OCA.8
  Bottom 0.406: SHIFTOUTA.7 20.65,34.2 v23.3,34.2
B-1  (via drill 0.5)
  Top 0.61: U_OCA1.1 24.22,62.42 v23.7,61.9
  Bottom 0.61: v23.7,61.9 24.4,62.6 24.4,64.1 25.21,64.92 SHIFTOUTB.15
B-2  (via drill 0.5)
  Top 0.406: v22.7,63.6 26.21,63.6 U_OCA1.2
  Bottom 0.406: SHIFTOUTB.1 20.82,63.6 v22.7,63.6
B-3  (via drill 0.5)
  Top 0.406: v23.3,64.9 26.24,64.9 U_OCA1.3
  Bottom 0.406: SHIFTOUTB.2 20.85,64.9 v23.3,64.9
B-4  (via drill 0.5)
  Top 0.406: v22.7,66.2 26.27,66.2 U_OCA1.4
  Bottom 0.406: SHIFTOUTB.3 20.85,66.2 v22.7,66.2
B-5  (via drill 0.5)
  Top 0.406: v23.3,67.5 U_OCA1.5
  Bottom 0.406: SHIFTOUTB.4 20.82,67.5 v23.3,67.5
B-6  (via drill 0.5)
  Top 0.406: v22.7,68.8 26.27,68.8 U_OCA1.6
  Bottom 0.406: SHIFTOUTB.5 20.79,68.8 v22.7,68.8
B-7  (via drill 0.5)
  Top 0.406: v23.3,70 26.26,70 U_OCA1.7
  Bottom 0.406: SHIFTOUTB.6 v23.3,70
B-8  (via drill 0.5)
  Top 0.406: v22.67,71.29 26.32,71.29 U_OCA1.8
  Bottom 0.406: SHIFTOUTB.7 20.87,71.29 v22.67,71.29
C-1  (via drill 0.5)
  Top 0.61: U_OCA2.1 54.72,73.78 v54.5,74
  Bottom 0.61: v54.5,74 55.9,72.6 56.9,72.6 57.28,72.22 SHIFTOUTC.15
C-2  (via drill 0.5)
  Top 0.406: v56,74.5 U_OCA2.2
  Bottom 0.406: SHIFTOUTC.1 56,76.93 v56,74.5
C-3  (via drill 0.5)
  Top 0.406: v57.3,75.1 57.3,71.84 U_OCA2.3
  Bottom 0.406: SHIFTOUTC.2 57.3,76.93 v57.3,75.1
C-4  (via drill 0.5)
  Top 0.406: v58.5,74.5 58.5,71.83 U_OCA2.4
  Bottom 0.406: SHIFTOUTC.3 58.5,76.97 v58.5,74.5
C-5  (via drill 0.5)
  Top 0.406: v59.8,75.1 U_OCA2.5
  Bottom 0.406: SHIFTOUTC.4 59.8,76.94 v59.8,75.1
C-6  (via drill 0.5)
  Top 0.406: v61.1,74.5 61.1,71.83 U_OCA2.6
  Bottom 0.406: SHIFTOUTC.5 v61.1,74.5
C-7  (via drill 0.5)
  Top 0.406: v62.4,75.1 62.4,71.86 U_OCA2.7
  Bottom 0.406: SHIFTOUTC.6 62.4,76.95 v62.4,75.1
C-8  (via drill 0.5)
  Top 0.406: v63.7,74.5 63.7,71.89 U_OCA2.8
  Bottom 0.406: SHIFTOUTC.7 63.7,76.98 v63.7,74.5
CE  (via drill 0.5, 0.6)
  Top 0.61: SHIFT1.15 26.34,11.73 27.1,12.5 28.4,12.5 28.8,12.9 28.8,22.6 30,23.8 30,49.6 | 30,49.6 28,51.6 28,57.8 31,60.8 31,66.2 34.5,69.7 40.92,69.7 | 40.92,69.7 41.2,69.7 43.8,72.3 49.6,72.3 50.8,71.1 50.8,70.1 53,67.9 67,67.9 70.4,64.5 70.4,50 | 70.4,50 70.4,48.3 71.8,46.9 71.8,45.6 70.3,44.1 v70.3,35.5 70.3,25.8 70.5,25.6 70.5,23.83 70.2,23.53 v70.2,14 | v74.8,14.3 74.8,16.54 SHIFT5.15 | SHIFT4.15 74.72,53.02 74.8,53.1 74.8,50.9 v73.9,50 | v69.7,49.9 69.8,50 70.4,50 | SHIFT3.15 40.53,74.67 v40.9,74.3 | v41.24,69.58 40.92,69.7 | SHIFT2.15 25.64,48.94 v25.7,49 | v30.2,49.1 30,49.6
  Bottom 0.406: 53.87,51.52 56.1,51.52 JP2.13
  Bottom 0.61: JP1.13 45.55,50.15 46.92,51.52 53.87,51.52 | v70.2,14 74.5,14 v74.8,14.3 | v73.9,50 69.8,50 v69.7,49.9 | v40.9,74.3 40.9,69.92 v41.24,69.58 | v25.7,49 30,49 v30.2,49.1 | JP2.13 61,46.62 61,35.5 62.5,34 66.9,34 68.4,35.5 v70.3,35.5
CLK  (via drill 0.5)
  Top 0.61: SHIFT1.2 26.34,22.93 28,24.6 28,48.6 25.64,50.97 SHIFT2.2 25.64,58.23 29,61.6 29,67 33.7,71.7 40.4,71.7 43.37,74.67 SHIFT3.2 44.75,74.7 50.2,74.7 52.8,72.1 52.8,70.9 53.8,69.9 68,69.9 72.4,65.5 72.4,49.3 73.1,48.6 74.4,48.6 74.72,48.27 SHIFT4.2 74.72,45.62 72.5,43.4 72.5,38.6 v73.6,37.5 73.6,36 72.5,34.9 72.5,13.1 73,12.6 74,12.6 74.84,11.76 SHIFT5.2
  Bottom 0.406: 53.88,48.99 56.09,48.99 JP2.11
  Bottom 0.61: JP1.11 46.01,47.61 47.39,48.99 53.88,48.99 | JP2.11 60,45.08 60,35 62,33 67.3,33 68.6,34.3 71.9,34.3 73.6,36 v73.6,37.5
D-1  (via drill 0.5)
  Top 0.61: v71.1,68.6 72.54,70.04 U_OCA3.1
  Bottom 0.61: SHIFTOUTD.15 71.75,67.55 71.1,68.2 v71.1,68.6
D-2  (via drill 0.5)
  Top 0.406: v77.79,68.76 U_OCA3.2
  Bottom 0.406: SHIFTOUTD.1 79.68,68.76 v77.79,68.76
D-3  (via drill 0.5)
  Top 0.406: v77.09,67.46 74.43,67.46 U_OCA3.3
  Bottom 0.406: SHIFTOUTD.2 79.71,67.46 v77.09,67.46
D-4  (via drill 0.5)
  Top 0.406: v77.79,66.26 74.42,66.26 U_OCA3.4
  Bottom 0.406: SHIFTOUTD.3 79.64,66.26 v77.79,66.26
D-5  (via drill 0.5)
  Top 0.406: v77.09,64.96 U_OCA3.5
  Bottom 0.406: SHIFTOUTD.4 79.67,64.96 v77.09,64.96
D-6  (via drill 0.5)
  Top 0.406: v77.79,63.76 74.46,63.76 U_OCA3.6
  Bottom 0.406: SHIFTOUTD.5 79.65,63.76 v77.79,63.76
D-7  (via drill 0.5)
  Top 0.406: v77.09,62.46 74.43,62.46 U_OCA3.7
  Bottom 0.406: SHIFTOUTD.6 v77.09,62.46
D-8  (via drill 0.5)
  Top 0.406: v77.79,61.16 U_OCA3.8
  Bottom 0.406: SHIFTOUTD.7 79.66,61.16 v77.79,61.16
E-1  (via drill 0.5)
  Top 0.61: v76.4,33.2 76.29,33.09 U_OCA4.1
  Bottom 0.61: SHIFTOUTE.15 75.14,30.55 75.6,31 75.6,32.4 v76.4,33.2
E-2  (via drill 0.5)
  Top 0.406: v77.22,31.81 U_OCA4.2
  Bottom 0.406: SHIFTOUTE.1 v77.22,31.81
E-3  (via drill 0.5)
  Top 0.406: v77.92,30.51 74.66,30.51 U_OCA4.3
  Bottom 0.406: SHIFTOUTE.2 79.79,30.51 v77.92,30.51
E-4  (via drill 0.5)
  Top 0.406: v77.22,29.21 74.69,29.21 U_OCA4.4
  Bottom 0.406: SHIFTOUTE.3 79.82,29.21 v77.22,29.21
E-5  (via drill 0.5)
  Top 0.406: v77.92,28.01 U_OCA4.5
  Bottom 0.406: SHIFTOUTE.4 v77.92,28.01
E-6  (via drill 0.5)
  Top 0.406: v77.32,26.71 74.65,26.71 U_OCA4.6
  Bottom 0.406: SHIFTOUTE.5 79.78,26.71 v77.32,26.71
E-7  (via drill 0.5)
  Top 0.406: v77.92,25.41 74.68,25.41 U_OCA4.7
  Bottom 0.406: SHIFTOUTE.6 79.81,25.41 v77.92,25.41
E-8  (via drill 0.5)
  Top 0.406: v77.32,24.21 U_OCA4.8
  Bottom 0.406: SHIFTOUTE.7 79.77,24.21 v77.32,24.21
GND  (via drill 0.5, 0.5 pad 0.25, 0.6, 0.6 pad 0.81, 0.7 pad 1.27)
  Top 0.406: v64.9,75.1 64.9,71.82 U_OCA2.9 | v77.09,59.86 74.41,59.86 U_OCA3.9 | v77.92,22.91 74.64,22.91 U_OCA4.9 | v23.3,72.6 26.28,72.6 U_OCA1.9
  Top 0.61: v33.53,30.42 40.12,30.42 42.18,32.48 | U_OCA.9 v22.72,35.48
  Top 0.813: JP1.8 JP1.6 JP1.4 JP1.2 41.83,32.87 | 56.4,30.8 56.4,32.2 54.84,33.77 54.84,35.05 JP2.2 | JP5.25 89.66,50.66 v89.6,50.6 | v81.9,49.4 82.34,48.95 SHIFT4.8
  Top 1.27: 41.83,32.87 42.18,32.48 44.9,29.5 v47.2,29.5 v51.9,29.5 55.1,29.5 56.4,30.8
  Bottom 0.406: SHIFTOUTC.8 v64.9,75.1 | SHIFTOUTD.8 79.56,59.86 v77.09,59.86 | SHIFTOUTE.8 79.77,22.91 v77.92,22.91 | 20.8,72.6 v23.3,72.6
  Bottom 0.61: SHIFTOUTE.13 75.09,28 75.6,27.5 75.6,23.61 76.3,22.91 v77.92,22.91 | v33.53,30.42 v33.52,30.43 SHIFTOUTA.13 25.38,30.43 24.7,31.1 24.7,34.6 23.82,35.48 v22.72,35.48 20.71,35.48 SHIFTOUTA.8
  Bottom 0.813: JP2.8 JP2.6 JP2.4 JP2.2 | JP1.8 41.83,34.93 | v89.6,50.6 85.2,50.6 84.2,49.6 82.1,49.6 v81.9,49.4
  other vias: 93.2,43.8 86.1,79 82.5,79.4 75.6,85.5 90.4,83.8 15.4,82.6 23.8,81.6 8.7,85.8 80.6,38.6 85.9,36.4 88,71.7 4.1,42.5 13.2,45.2 14.6,58.8 18.7,58.9 14.5,17.4 11.4,6.7 15.6,4.2 18.9,21.9 48.3,46 51.6,34.9 51.5,78.7
  pour Bottom: 0,0 0,88 99.5,88 99.5,0
  pour Top: 0,0 0,88 99.5,88 99.5,0
N$1  (via drill 0.5 pad 0.25)
  other vias: 48.2,55.5
N$2  (via drill 0.5 pad 0.25)
  other vias: 51.9,55.5
N$3  (via drill 0.5 pad 0.25)
  other vias: 9.9,4.3
N$14  (via drill 0.5)
  other vias: 71.5,5.8
N$15  (via drill 0.5)
  other vias: 75.4,4.7
N$16  (via drill 0.5)
  other vias: 89.9,7.3
N$18
  Top 0.61: SHIFT2.10 19.29,47.22 16.6,49.9 16.6,60.1 18.3,61.8 18.3,76.4 20.7,78.8 26.7,78.8 30.18,82.28 SHIFT3.9
N$21
  Top 0.61: SHIFT3.10 39.81,81.02 40.4,81.6 40.4,82.8 40.9,83.3 49.8,83.3 53.3,79.8 63,79.8 70.7,72.1 82,72.1 82.34,71.75 SHIFT4.9
N$22
  Top 0.61: SHIFT5.9 82.5,16.62 82.5,34 83.5,35 83.5,50.4 82.9,51 81.8,51 81.1,51.7 81.1,52.9 | SHIFT4.10 81.1,52.9 | 81.1,52.9 81.1,53.2
N$26  (via drill 0.6)
  Top 0.61: v31.2,35.5 31,35.7 31,48.1 31.5,48.6 31.5,49.6 29,52.1 29,57.4 32,60.4 32,65.4 v32.3,65.7
  Bottom 0.61: SHIFTOUTA.9 v31.2,35.51 v31.2,35.5 | v32.3,65.7 31.82,66.19 SHIFTOUTB.14
N$31  (via drill 0.6)
  Top 0.61: v68.5,64.5 68.7,64.7 66.5,66.9 65.6,66.9 v65.4,66.7
  Bottom 0.61: SHIFTOUTC.9 64.91,67.2 v65.4,66.7 | v68.5,64.5 70.3,66.3 73.45,66.3 SHIFTOUTD.14
N$37  (via drill 0.6)
  Top 0.61: v35.6,68.7 40.4,68.7 40.7,68.4 41.8,68.4 42.5,69.1 42.5,69.5 44.3,71.3 49.1,71.3 49.8,70.6 49.8,69.7 52.6,66.9 58.3,66.9 v58.1,66.7
  Bottom 0.61: SHIFTOUTB.9 35.37,72.53 36,71.9 36,69.1 v35.6,68.7 | v58.1,66.7 58.55,67.14 SHIFTOUTC.14
N$38  (via drill 0.6)
  Top 0.61: v69.2,59.9 69.4,59.7 69.4,51.3 68.5,50.4 68.5,49.4 69.4,48.5 69.4,47.8 70.8,46.4 70.8,46 69,44.2 69,31.4 v68.9,31.3
  Bottom 0.61: SHIFTOUTD.9 69.78,59.92 v69.2,59.9 | 73.58,29.3 SHIFTOUTE.14 70.92,29.27 v68.9,31.3
N$50
  Top 0.61: SHIFT1.10 19.98,11.52 19.2,12.3 17.5,12.3 17.1,12.7 17.1,23.7 18,24.6 18,45.92 SHIFT2.9
OUTA1
  Top 0.406: 6.9,7.7 4.57,7.7 JP3.2
  Top 0.61: 6.9,7.7 10.2,11 10.2,13.8 13.1,16.7 13.1,21.42 16.2,24.52 U_OCA.18
OUTA2
  Top 0.406: 6.9,10.3 4.63,10.3 JP3.4
  Top 0.61: 6.9,10.3 7.4,10.3 8.3,11.2 8.3,12.5 9.2,13.4 9.2,14.2 12.1,17.1 12.1,21.8 14.5,24.2 14.5,26 15.09,26.59 U_OCA.17
OUTA3
  Top 0.406: 6.9,12.8 4.59,12.8 JP3.6
  Top 0.61: 6.9,12.8 7.3,12.8 8.2,13.7 8.2,14.7 11.1,17.6 11.1,22.2 13.5,24.6 13.5,26.4 14.96,27.86 U_OCA.16
OUTA4
  Top 0.406: 6.9,15.4 6.87,15.37 4.62,15.37 JP3.8
  Top 0.61: 6.9,15.4 7.5,15.4 10.1,18 10.1,22.6 12.5,25 12.5,26.8 14.83,29.13 U_OCA.15
OUTA5
  Top 0.406: 6.9,17.9 4.61,17.9 JP3.10
  Top 0.61: 6.9,17.9 7.5,17.9 9.1,19.5 9.1,23 11.5,25.4 11.5,27.2 14.7,30.4 U_OCA.14
OUTA6
  Top 0.406: 6.9,20.4 4.57,20.4 JP3.12
  Top 0.61: 6.9,20.4 8.1,21.6 8.1,23.3 10.5,25.7 10.5,27.6 14.57,31.67 U_OCA.13
OUTA7
  Top 0.406: JP3.14 4.63,23 6.7,23 7.2,23.5 7.2,23.7 7.5,24 7.5,24.1
  Top 0.61: 7.5,24.1 7.6,24.1 9.5,26 9.5,27.9 14.54,32.94 U_OCA.12
OUTA8
  Top 0.406: 6.9,25.5 4.59,25.5 JP3.16
  Top 0.61: 6.9,25.5 8.5,27.1 8.5,28.3 14.41,34.21 U_OCA.11
OUTB1
  Top 0.406: 6.85,28.06 4.61,28.06 JP3.18
  Top 0.61: 6.85,28.06 6.89,28.1 7.9,29.1 9.5,30.7 9.5,53 12.5,56 12.5,59.3 15.62,62.42 U_OCA1.18
OUTB2
  Top 0.406: 6.92,30.6 4.61,30.6 JP3.20
  Top 0.61: 6.92,30.6 7.2,30.6 8.5,31.9 8.5,53.4 11.5,56.4 11.5,59.7 15.49,63.69 U_OCA1.17
OUTB3
  Top 0.406: 6.66,51.92 4.57,51.92 JP4.2
  Top 0.61: 6.66,51.92 7.5,52.76 7.5,53.8 10.5,56.8 10.5,60.1 15.36,64.96 U_OCA1.16
OUTB4
  Top 0.406: 6.72,54.46 4.58,54.46 JP4.4
  Top 0.61: 6.72,54.46 9.5,57.24 9.5,60.5 15.23,66.23 U_OCA1.15
OUTB5
  Top 0.406: 6.7,57 4.58,57 JP4.6
  Top 0.61: 6.7,57 8.5,58.8 8.5,60.9 15.1,67.5 U_OCA1.14
OUTB6
  Top 0.406: 6.71,59.55 4.6,59.55 JP4.8
  Top 0.61: 6.71,59.55 7.5,60.34 7.5,61.4 14.87,68.77 U_OCA1.13
OUTB7
  Top 0.406: 6.7,62.1 4.6,62.1 JP4.10
  Top 0.61: 6.7,62.1 14.64,70.04 U_OCA1.12
OUTB8
  Top 0.406: 6.69,64.62 4.59,64.62 JP4.12
  Top 0.61: 6.69,64.62 7.62,64.62 14.31,71.31 U_OCA1.11
OUTC1
  Top 0.406: 6.83,67.16 4.58,67.16 JP4.14
  Top 0.61: U_OCA2.18 54.72,82.78 53.4,84.1 14.6,84.1 11.2,80.7 11.2,71.53 6.83,67.16
OUTC2
  Top 0.406: 6.8,69.7 4.58,69.7 JP4.16
  Top 0.61: U_OCA2.17 55.99,83.11 54,85.1 14.2,85.1 10.2,81.1 10.2,73.1 6.8,69.7
OUTC3
  Top 0.406: 6.83,72.24 4.58,72.24 JP4.18
  Top 0.61: U_OCA2.16 57.26,83.34 54.5,86.1 13.8,86.1 9.2,81.5 9.2,74.61 6.83,72.24
OUTC4
  Top 0.406: 6.8,74.8 4.6,74.8 JP4.20
  Top 0.61: U_OCA2.15 58.53,83.57 55,87.1 13.3,87.1 8.2,82 8.2,76.2 6.8,74.8
OUTC5
  Top 0.61: U_OCA2.14 59.8,83.5 63.1,86.8 68.2,86.8 71.2,83.8 87.7,83.8 89.3,82.2 92.5,82.2 92.9,82.6 94.84,82.6 JP5.2
OUTC6
  Top 0.406: 92.81,79.87 95.03,79.87 JP5.4
  Top 0.61: U_OCA2.13 61.07,83.37 63.5,85.8 67.8,85.8 70.8,82.8 87.3,82.8 90.23,79.87 92.81,79.87
OUTC7
  Top 0.406: 92.81,77.33 95.03,77.33 JP5.6
  Top 0.61: U_OCA2.12 62.34,83.24 63.9,84.8 67.4,84.8 70.4,81.8 86.9,81.8 91.37,77.33 92.81,77.33
OUTC8
  Top 0.406: 92.8,74.8 95.02,74.8 JP5.8
  Top 0.61: U_OCA2.11 63.61,83.01 64.4,83.8 67,83.8 70,80.8 86.5,80.8 92.5,74.8 92.8,74.8
OUTD1
  Top 0.406: 92.8,69.7 95.02,69.7 JP5.10
  Top 0.61: U_OCA3.18 84.2,70.03 85.61,70.03 85.94,69.7 92.8,69.7
OUTD2
  Top 0.406: 92.77,67.16 95.02,67.16 JP5.12
  Top 0.61: U_OCA3.17 84.97,68.77 85,68.8 85.4,68.8 85.6,68.6 88,68.6 89.44,67.16 92.77,67.16
OUTD3
  Top 0.406: 92.8,64.62 95.02,64.62 JP5.14
  Top 0.61: U_OCA3.16 87.6,67.5 90.48,64.62 92.8,64.62
OUTD4
  Top 0.406: 92.8,62.1 95.04,62.1 JP5.16
  Top 0.61: U_OCA3.15 87.47,66.23 91.6,62.1 92.8,62.1
OUTD5
  Top 0.406: 92.77,59.56 95.04,59.56 JP5.18
  Top 0.61: U_OCA3.14 87.24,64.96 92.64,59.56 92.77,59.56
OUTD6
  Top 0.406: 92.8,57 95.02,57 JP5.20
  Top 0.61: U_OCA3.13 87.01,63.69 91.7,59 91.7,57.7 92.4,57 92.8,57
OUTD7
  Top 0.61: U_OCA3.12 85.88,62.42 87.8,60.5 87.8,43.4 92.1,39.1 94.1,39.1 JP6.2
OUTD8
  Top 0.406: 92.68,35.74 94.92,35.74 JP6.4
  Top 0.61: U_OCA3.11 85.45,61.15 86.8,59.8 86.8,42.8 91.5,38.1 91.5,36.5 92.26,35.74 92.68,35.74
OUTE1
  Top 0.406: 92.7,33.2 94.92,33.2 JP6.6
  Top 0.61: U_OCA4.18 84.53,33.2 92.7,33.2
OUTE2
  Top 0.406: 92.7,30.65 92.85,30.65 92.9,30.6 94.98,30.6 JP6.8
  Top 0.61: U_OCA4.17 88.88,31.82 90.05,30.65 92.7,30.65
OUTE3
  Top 0.406: 92.7,28.1 94.94,28.1 JP6.10
  Top 0.61: U_OCA4.16 88.55,30.55 91,28.1 92.7,28.1
OUTE4
  Top 0.406: 92.71,25.57 94.93,25.57 JP6.12
  Top 0.61: U_OCA4.15 88.22,29.28 91.93,25.57 92.71,25.57
OUTE5
  Top 0.406: 92.68,23.03 94.93,23.03 JP6.14
  Top 0.61: U_OCA4.14 87.69,28.01 92.17,23.53 92.68,23.03
OUTE6
  Top 0.406: 92.64,20.5 94.92,20.5 JP6.16
  Top 0.61: U_OCA4.13 87.36,26.74 91.3,22.9 91.3,21.3 92.1,20.5 92.64,20.5
OUTE7
  Top 0.406: 92.71,17.95 92.75,17.95 92.8,17.9 94.98,17.9 JP6.18
  Top 0.61: U_OCA4.12 87.13,25.47 90.3,22.3 90.3,19.6 91.95,17.95 92.71,17.95
OUTE8
  Top 0.406: 92.72,15.41 94.93,15.41 JP6.20
  Top 0.61: U_OCA4.11 86.8,24.2 89.3,21.7 89.3,18.2 92.09,15.41 92.72,15.41
PL  (via drill 0.5)
  Top 0.61: SHIFT1.1 27.61,22.8 29,24.2 29,49.1 26.9,51.2 SHIFT2.1 26.91,58.1 30,61.2 30,66.6 34.1,70.7 40.8,70.7 43.5,73.4 SHIFT3.1 50.01,73.39 51.8,71.6 51.8,70.5 53.4,68.9 67.5,68.9 71.4,65 71.4,48.9 73.45,46.84 SHIFT4.1 73.45,45.76 71.5,43.8 71.5,37.2 v72,36.7 72,35.9 71.5,35.4 71.5,12.51 SHIFT5.1
  Bottom 0.61: JP1.15 45.98,54.3 55.86,54.3 JP2.15 62,48.16 62,36 63,35 66.4,35 68.1,36.7 v72,36.7
Q7  (via drill 0.5, 0.6, 0.6 pad 0.81)
  Top 0.61: SHIFT1.9 18.71,6.08 v21,3.8 | JP1.9 46,43.44 46,31.7 v45.7,31.4 | v29,8.7 29.8,9.5 29.8,22.2 31,23.4 31,26.8 32.4,28.2 v42.5,28.2
  Bottom 0.61: v21,3.8 22.5,3.8 25.9,7.2 27.5,7.2 v29,8.7 | v42.5,28.2 v45.7,31.4
Q7_2  (via drill 0.6)
  Top 0.61: v81.9,35.2 81.5,34.8 81.5,19.3 81.2,19 SHIFT5.10
  Bottom 0.61: JP2.9 59,43.54 59,34.5 61.5,32 67.7,32 69,33.3 72.5,33.3 75,35.8 81.3,35.8 v81.9,35.2
SHCP  (via drill 0.5, 0.6)
  Top 0.61: v37.5,33 37.5,55.6 39.7,57.8 v39.9,57.8 60.6,57.8 61.8,56.6 v61.8,56.5 61.9,56.5 62.6,55.8 v62.6,29.8 | v61.8,66.5 63.8,64.5 64.9,64.5 65.8,63.6 v65.8,62.2
  Bottom 0.406: JP1.14 43.08,48.9 45.2,48.9
  Bottom 0.61: 45.2,48.9 45.8,48.9 47.15,50.25 JP2.14 | SHIFTOUTA.11 26.87,33 v37.5,33 | SHIFTOUTE.11 71.44,25.46 67.1,29.8 v62.6,29.8 | SHIFTOUTD.11 72.27,62.47 72,62.2 v65.8,62.2 62.9,59.3 62.9,57.6 v61.8,56.5 | SHIFTOUTC.11 62.37,67.06 v61.8,66.5 | SHIFTOUTB.11 33.01,70 33.4,69.6 33.4,67.7 34.7,66.4 35.9,66.4 37,65.3 37,59.7 38.9,57.8 v39.9,57.8 41.2,57.8 42.3,56.7 42.3,56.1 40.3,54.1 40.3,51.68 JP1.14
SR_DS
  Bottom 0.61: JP1.10 40,43.24 40,31.3 37.85,29.16 SHIFTOUTA.14
SR_DS_2  (via drill 0.5, 0.6)
  Top 0.61: JP2.10 53.2,43.54 53.2,31.9 v53.6,31.5 | v58.5,27.5 67,27.5 69.3,25.2 v69.3,24.5
  Bottom 0.61: 71.67,22.93 SHIFTOUTE.9 70.88,22.93 v69.3,24.5 | v53.6,31.5 57.6,27.5 v58.5,27.5
SR_RST  (via drill 0.5, 0.6)
  Top 0.61: v36.3,34.2 36.3,55.8 39.5,59 v39.3,59 61.1,59 v63.5,56.6 63.8,56.3 v63.8,28.7 | v63.65,66.52 64.67,65.5 66.5,65.5 67.3,64.7 67.3,61.3 v67.1,61.1
  Bottom 0.406: JP1.16 43.1,51.42 45.36,51.42
  Bottom 0.61: 45.36,51.42 46.73,52.79 JP2.16 | SHIFTOUTA.10 26.87,34.2 v36.3,34.2 | SHIFTOUTE.10 71,24.2 70.5,24.7 70.5,25 66.8,28.7 v63.8,28.7 | SHIFTOUTD.10 67.19,61.2 v67.1,61.1 66.1,61.1 63.9,58.9 63.9,57 v63.5,56.6 | SHIFTOUTC.10 v63.65,66.52 | SHIFTOUTB.10 33.73,71.27 34.4,70.6 34.4,68.1 35.1,67.4 36.3,67.4 38,65.7 38,60.3 v39.3,59 41.7,59 43.3,57.4 43.3,55.6 41.83,54.13 JP1.16
STCP  (via drill 0.5, 0.6)
  Top 0.61: v38.7,31.7 38.7,55.2 40.2,56.7 40.5,56.7 v40.7,56.5 40.9,56.7 59.8,56.7 v60,56.5 61.5,55 61.5,30.9 v61.3,30.8 | v59.9,66.5 63.3,63.1 v64.5,63.1
  Bottom 0.406: JP1.12 43.09,46.35 45.24,46.35
  Bottom 0.61: 45.24,46.35 46.25,46.35 47.61,47.71 JP2.12 | SHIFTOUTA.12 v38.7,31.7 | SHIFTOUTE.12 71.56,26.73 67.3,31 61.5,31 v61.3,30.8 | SHIFTOUTD.12 71.94,63.73 71.4,63.2 64.6,63.2 v64.5,63.1 64.5,62.3 61.9,59.7 61.9,58.3 v60,56.5 | SHIFTOUTC.12 61.09,67.89 59.8,66.6 v59.9,66.5 | SHIFTOUTB.12 32.17,68.72 32.4,68.5 32.4,67.3 34.3,65.4 35.5,65.4 36,64.9 36,59.2 38.5,56.7 40.5,56.7 v40.7,56.5 40.7,56.1 39.3,54.7 39.3,50.14 JP1.12
TRITRONIK
  cutout Top (isolate 0.254): 47.5,37.3 47.2,36.4 47.9,35.1 48.7,35.4 arc90 49.7,34.4 arc-90 49.1,35 49.1,35.6 51.9,36.6 49,36.5 49,37.3 48.7,37.3 48.7,36.5 47.3,36.4
VCC  (via drill 0.5, 0.6, 0.6 pad 0.81)  (2 unrouted)
  Top 0.61: SHIFT5.16 73.58,19.27 76.1,21.8 78.2,21.8 80.4,24 80.4,32.3 78.1,34.6 v76.7,34.6 | SHIFT2.16 26.91,44.1 v26.1,43.3 | SHIFT4.16 73.45,53.76 78.9,59.2 80.3,59.2 81.2,60.1 81.2,69 79.9,70.3 v77,70.3
  Top 0.813: SHIFT1.16 27.61,8.2 28.5,7.3 30,7.3 31.1,8.4 31.1,21.8 32.2,22.9 32.2,25.6 33.1,26.5 34.41,26.5 | v76.7,37.1 v76.7,34.6 | JP2.3 59.65,37.55 60.1,38 60.1,53.6 v59.8,53.9 | 34.3,26.61 34.41,26.5 | 34.41,26.5 RN1.1 | v26.1,43.3 19.2,36.4 19.2,24.9 20.1,24 v23.7,24 | SHIFT3.16 29.61,73.39 28.6,74.4 20.8,74.4 19.5,73.1 19.5,61.3 v22.7,58.1
  Bottom 0.61: SHIFTOUTA.16 34.3,26.61 RN1.1 | 75.31,31.82 SHIFTOUTE.16 73.6,32.8 75.4,34.6 v76.7,34.6 | RN3.1 60.67,61.83 56,66.5 56,70.75 SHIFTOUTC.16 55.03,70.77 52.3,73.5 C3.1 | SHIFTOUTB.16 32.55,63.65 34.2,62 RN2.1 | SHIFTOUTD.16 73.49,68.8 74,68.8 75.8,68.8 77,70 v77,70.3 82.55,70.3 C4.1 | C1.1 18.45,24 v23.7,24
  Bottom 0.813: JP1.7 JP1.5 JP1.3 JP1.1 44.37,33.97 36.8,26.4 34.51,26.4 RN1.1 33.06,26.46 29.5,22.9 24.8,22.9 v23.7,24 | JP2.7 JP2.5 JP2.3 JP2.1 57.37,32.23 63.6,26 63.6,7 65,5.6 65.9,5.6 RN5.1 | v26.1,43.3 26.1,42.9 33.4,35.6 v34.3,35.6 34.7,36 36.2,36 37.2,37 37.2,56 35.05,58.15 RN2.1 34.14,58.1 v22.7,58.1 19.2,61.6 C2.1 | 74,68.8 73,68.8 71.8,70 67.9,70 67,69.1 67,66.2 66.1,65.3 64.81,65.3 RN3.1 60.67,59.77 58.5,57.6 58.5,55.2 v59.8,53.9 60.6,53.9 63.5,51 63.5,39.4 65.1,37.8 65.92,37.8 RN4.1 66.88,37.78 68.4,39.3 74.8,39.3 v76.7,37.1 77.95,37.1 C5.1
  Bottom 1.27: 44.4,34.9 46.3,33 56.1,33 57.4,34.3 57.4,34.9

### Text on the board
Top: Tritronik